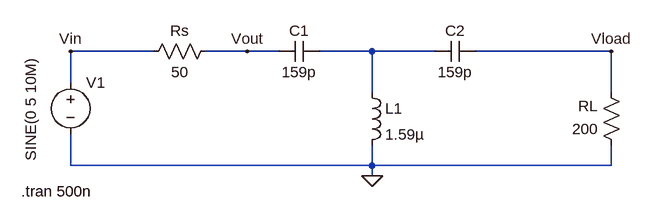
[diagram p0: schematic T_Section.asc]
T_Section.asc, the LTspice schematic file:
Version 4
SHEET 1 880 680
WIRE 128 48 0 48
WIRE 272 48 208 48
WIRE 320 48 272 48
WIRE 464 48 384 48
WIRE 560 48 464 48
WIRE 832 48 624 48
WIRE 0 96 0 48
WIRE 464 112 464 48
WIRE 832 112 832 48
WIRE 0 224 0 176
WIRE 464 224 464 192
WIRE 464 224 0 224
WIRE 832 224 832 192
WIRE 832 224 464 224
WIRE 464 240 464 224
FLAG 464 240 0
FLAG 832 48 Vload
FLAG 0 48 Vin
FLAG 272 48 Vout
SYMBOL voltage 0 80 R0
WINDOW 3 -61 -22 VRight 2
WINDOW 123 0 0 Left 2
WINDOW 39 0 0 Left 2
SYMATTR InstName V1
SYMATTR Value SINE(0 5 10M)
SYMBOL res 224 32 R90
WINDOW 0 0 56 VBottom 2
WINDOW 3 32 56 VTop 2
SYMATTR InstName Rs
SYMATTR Value 50
SYMBOL res 848 208 R180
WINDOW 0 36 76 Left 2
WINDOW 3 36 40 Left 2
SYMATTR InstName RL
SYMATTR Value 200
SYMBOL cap 384 32 R90
WINDOW 0 0 32 VBottom 2
WINDOW 3 32 32 VTop 2
SYMATTR InstName C1
SYMATTR Value 159p
SYMBOL cap 624 32 R90
WINDOW 0 0 32 VBottom 2
WINDOW 3 32 32 VTop 2
SYMATTR InstName C2
SYMATTR Value 159p
SYMBOL ind 448 96 R0
SYMATTR InstName L1
SYMATTR Value 1.59µ
TEXT -76 264 Left 2 !.tran 500n

The netlist it stands for:
* T_Section.asc
V1 Vin 0 SINE(0 5 10M)
Rs Vout Vin 50
RL 0 Vload 200
C1 N001 Vout 159p
C2 Vload N001 159p
L1 N001 0 1.59µ
.tran 500n
.backanno
.end